# EAGLE design color_proximity_sensor (EAGLE 7.4.0)
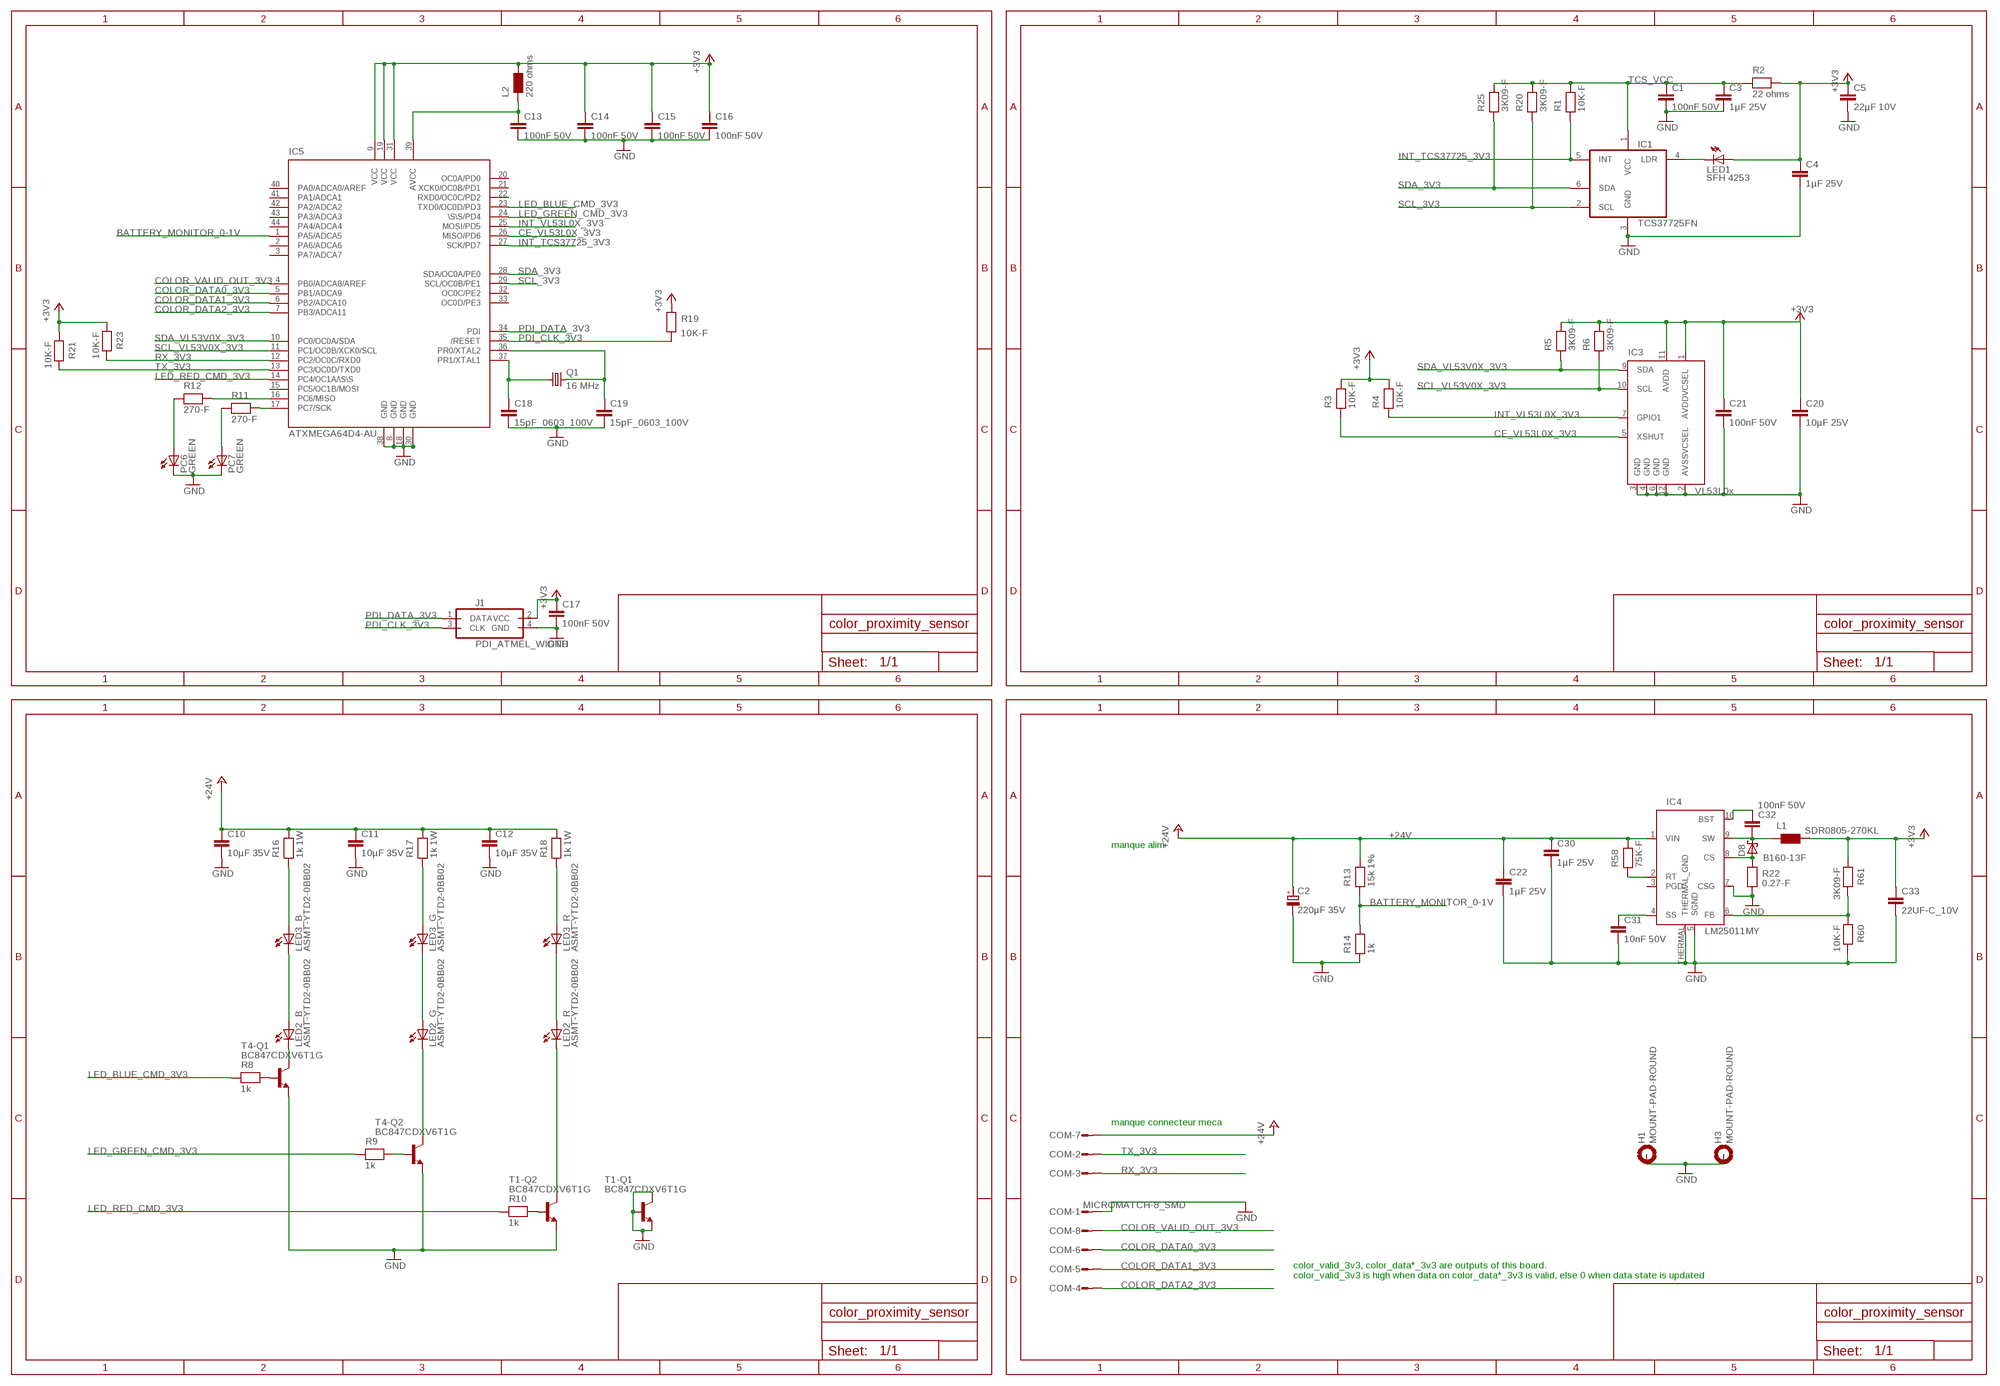
[diagram p0: schematic, sheet 1]

## Parts
C1  100nF 50V  100NF-F  [C0603]
C2  220µF 35V  220UFF_35V  [PANASONIC_F]
C3  1µF 25V  1UFD_25V  [C1206]
C4  1µF 25V  1UFD_25V  [C1206]
C5  22µF 10V  22UF-C_10V  [C1210]
C10  10µF 35V  10UF-C_35V  [C1210]
C11  10µF 35V  10UF-C_35V  [C1210]
C12  10µF 35V  10UF-C_35V  [C1210]
C13  100nF 50V  100NF-F  [C0603]
C14  100nF 50V  100NF-F  [C0603]
C15  100nF 50V  100NF-F  [C0603]
C16  100nF 50V  100NF-F  [C0603]
C17  100nF 50V  100NF-F  [C0603]
C18  15pF_0603_100V  15PF-F  [C0603]
C19  15pF_0603_100V  15PF-F  [C0603]
C20  10µF 25V  10UF-C_25V  [C1210]
C21  100nF 50V  100NF-F  [C0603]
C22  1µF 25V  1UFD_25V  [C1206]
C30  1µF 25V  1UFD_25V  [C1206]
C31  10nF 50V  10NF-F  [C0603]
C32  100nF 50V  100NF-F  [C0603]
C33  22UF-C_10V  [C1210]
COM  MICROMATCH-8_SMD  [MICROMATCH-8_SMD]
D8  B160-13F  [SMA]
H1  MOUNT-PAD-ROUND  [2,1-PAD]
H3  MOUNT-PAD-ROUND  [2,1-PAD]
IC1  TCS37725FN  [FN6]
IC3  VL53L0x  VL53L0X  [LGA12]
IC4  LM25011MY  [MSOP10_THERMAL]
IC5  ATXMEGA64D4-AU  [TQFP44]
J1  PDI_ATMEL_WIDTH  [HEADER_2.54MM_2X2W_]
L1  SDR0805-270KL  [SDR0805]
L2  220 ohms  FERRITE_220OHMS  [R0603]
LED1  SFH 4253  SFH4253  [SFH4253]
LED2  ASMT-YTD2-0BB02  LED_MULTICOLOR  [PLCC6]
LED3  ASMT-YTD2-0BB02  LED_MULTICOLOR  [PLCC6]
PC6  GREEN  LED_G  [CHIP-LED0805]
PC7  GREEN  LED_G  [CHIP-LED0805]
Q1  16 MHz  CRYSTAL_16MHZ_HC49UP  [HC49UP]
R1  10K-F  [R0603]
R2  22 ohms  22-F  [R0603]
R3  10K-F  [R0603]
R4  10K-F  [R0603]
R5  3K09-F  [R0603]
R6  3K09-F  [R0603]
R8  1k  1K-F  [R0603]
R9  1k  1K-F  [R0603]
R10  1k  1K-F  [R0603]
R11  270-F  [R0603]
R12  270-F  [R0603]
R13  15k 1%  15K-E  [R0805]
R14  1k  1K-E  [R0805]
R16  1k 1W  1K-A  [R2512]
R17  1k 1W  1K-A  [R2512]
R18  1k 1W  1K-A  [R2512]
R19  10K-F  [R0603]
R20  3K09-F  [R0603]
R21  10K-F  [R0603]
R22  0.27-F  [R0603]
R23  10K-F  [R0603]
R25  3K09-F  [R0603]
R58  75K-F  [R0603]
R60  10K-F  [R0603]
R61  3K09-F  [R0603]
T1  BC847CDXV6T1G  BC847CDXV6T  [SOT563-6]
T4  BC847CDXV6T1G  BC847CDXV6T  [SOT563-6]

## Nets
+3V3: C4.1 C5.1 C14.1 C15.1 C16.1 C17.1 C20.1 C21.1 C33.1 IC3.1(AVDDVCSEL) IC3.11(AVDD) IC5.9(VCC) IC5.19(VCC) IC5.31(VCC) J1.2(VCC) L1.2 L2.2 LED1.A R2.2 R3.2 R4.2 R5.2 R6.2 R19.2 R21.1 R23.1 R61.1
+24V: C2.+ C10.1 C11.1 C12.1 C22.1 C30.1 COM.7 IC4.1(VIN) R13.2 R16.2 R17.2 R18.2 R58.2
BATTERY_MONITOR_0-1V: IC5.1(PA5/ADCA5) R13.1 R14.2
CE_VL53L0X_3V3: IC3.5(XSHUT) IC5.26(MISO/PD6) R3.1
COLOR_DATA0_3V3: COM.6 IC5.5(PB1/ADCA9)
COLOR_DATA1_3V3: COM.5 IC5.6(PB2/ADCA10)
COLOR_DATA2_3V3: COM.4 IC5.7(PB3/ADCA11)
COLOR_VALID_OUT_3V3: COM.8 IC5.4(PB0/ADCA8/AREF)
GND: C1.2 C2.- C3.2 C4.2 C5.2 C10.2 C11.2 C12.2 C13.2 C14.2 C15.2 C16.2 C17.2 C18.2 C19.2 C20.2 C21.2 C22.2 C30.2 C31.2 C33.2 COM.1 H1.B2,8(MOUNT) H3.B2,8(MOUNT) IC1.3(GND) IC3.2(AVSSVCSEL) IC3.3(GND) IC3.4(GND) IC3.6(GND) IC3.12(GND) IC4.5(SGND) IC4.7(CSG) IC4.THERMAL(THERMAL_GND) IC5.8(GND) IC5.18(GND) IC5.30(GND) IC5.38(GND) J1.4(GND) PC6.C PC7.C R14.1 R22.1 R60.2 T1.1(-Q2:E) T1.3(-Q1:C) T1.4(-Q1:E) T1.5(-Q1:B) T4.1(-Q2:E) T4.4(-Q1:E)
INT_TCS37725_3V3: IC1.5(INT) IC5.27(SCK/PD7) R1.1
INT_VL53L0X_3V3: IC3.7(GPIO1) IC5.25(MOSI/PD5) R4.1
LED_BLUE_CMD_3V3: IC5.23(TXD0/OC0D/PD3) R8.1
LED_GREEN_CMD_3V3: IC5.24(\S\S/PD4) R9.1
LED_RED_CMD_3V3: IC5.14(PC4/OC1A/\S\S) R10.1
N$1: R8.2 T4.5(-Q1:B)
N$3: R9.2 T4.2(-Q2:B)
N$4: IC1.4(LDR) LED1.C
N$5: R10.2 T1.2(-Q2:B)
N$6: LED3.4(_R:A) R18.1
N$7: LED2.2(_G:C) T4.6(-Q2:C)
N$8: LED2.3(_R:C) T1.6(-Q2:C)
N$9: LED2.1(_B:C) T4.3(-Q1:C)
N$10: LED2.6(_B:A) LED3.1(_B:C)
N$11: LED3.5(_G:A) R17.1
N$12: LED3.6(_B:A) R16.1
N$13: IC5.17(PC7/SCK) R11.2
N$14: LED2.5(_G:A) LED3.2(_G:C)
N$15: LED2.4(_R:A) LED3.3(_R:C)
N$16: IC5.16(PC6/MISO) R12.2
N$17: C13.1 IC5.39(AVCC) L2.1
N$19: C18.1 IC5.37(PR1/XTAL1) Q1.1
N$20: C19.1 IC5.36(PR0/XTAL2) Q1.2
N$21: PC7.A R11.1
N$22: PC6.A R12.1
N$38: C32.2 D8.C IC4.9(SW) L1.1
N$39: D8.A IC4.8(CS) R22.2
N$40: IC4.2(RT) R58.1
N$43: C31.1 IC4.4(SS)
N$44: IC4.6(FB) R60.1 R61.2
N$48: C32.1 IC4.10(BST)
PDI_CLK_3V3: IC5.35(/RESET) J1.3(CLK) R19.1
PDI_DATA_3V3: IC5.34(PDI) J1.1(DATA)
RX_3V3: COM.3 IC5.12(PC2/OC0C/RXD0) R23.2
SCL_3V3: IC1.2(SCL) IC5.29(SCL/OC0B/PE1) R20.1
SCL_VL53V0X_3V3: IC3.10(SCL) IC5.11(PC1/OC0B/XCK0/SCL) R6.1
SDA_3V3: IC1.6(SDA) IC5.28(SDA/OC0A/PE0) R25.1
SDA_VL53V0X_3V3: IC3.9(SDA) IC5.10(PC0/OC0A/SDA) R5.1
TCS_VCC: C1.1 C3.1 IC1.1(VCC) R1.2 R2.1 R20.2 R25.2
TX_3V3: COM.2 IC5.13(PC3/OC0D/TXD0) R21.2
Unconnected: IC4.3(PGD) IC5.2(PA6/ADCA6) IC5.3(PA7/ADCA7) IC5.15(PC5/OC1B/MOSI) IC5.20(OC0A/PD0) IC5.21(XCK0/OC0B/PD1) IC5.22(RXD0/OC0C/PD2) IC5.32(OC0C/PE2) IC5.33(OC0D/PE3) IC5.40(PA0/ADCA0/AREF) IC5.41(PA1/ADCA1) IC5.42(PA2/ADCA2) IC5.43(PA3/ADCA3) IC5.44(PA4/ADCA4)

## Notes on the sheet
- manque alim
- manque connecteur meca
- color_valid_3v3, color_data*_3v3 are outputs of this board.
  color_valid_3v3 is high when data on color_data*_3v3 is valid, else 0 when data state is updated

## Library data of the parts
C1 C13-C17 C21 C32 = robotter_capacitor:100NF; MOUSER: 81-GRM188F51H104ZA01; RS: 723-5534
C2 = robotter_capacitor:220UF; MOUSER: 667-EEE-FP1V221AP; RS: 568-828
C3 C4 C22 C30 = robotter_capacitor:1UF; MOUSER: 810-C3216X7R1E105K-6; RS: 740-7574
C5 = robotter_capacitor:22UF; MOUSER: 581-1210ZG226Z; RS: 698-3844
C10-C12 = robotter_capacitor:10UF; MOUSER: 963-GMK325BJ106MN-T; RS: 758-3325
C18 C19 = robotter_capacitor:15PF; MOUSER: 581-06031A150K4T2A; RS: 147-421
C20 = robotter_capacitor:10UF; MOUSER: 963-TMK316BJ106KL-T; RS: 766-1185
C31 = robotter_capacitor:10NF; MOUSER: 81-GCM188R71H103KA7D; RS: 723-4982
C33 = robotter_capacitor:22UF; MOUSER: 581-1210ZG226Z; RS: 698-3844; VALUE: 22µF 10V
COM = robotter_connector:MICROMATCH-8_SMD: Ref FN : 1865096; FARNELL: 1865096; MOUSER: 571-7-188275-8; RS: 739-1227
D8 = robotter_diode:B160-13F; MOUSER: 621-B160-F; RS: 738-4765
H1 H3 = robotter_others:MOUNT-PAD-ROUND: MOUNTING PAD, round
IC1 = robotter_ic:TCS3772; I2C_ADDRESS: 0x29; MOUSER: 985-TCS37725FN; RS: 785-7749
IC3 = robotter_ic:VL53L0X
IC4 = robotter_ic:LM25011: 42V 2A step down switching regulator http://www.ti.com/product/lm25011; MOUSER: 926-LM25011MY/NOPB; RS: 761-4883
IC5 = robotter_ic:ATXMEGA64D4; MOUSER: 556-ATXMEGA64D4-AU
J1 = robotter_connector:PDI_ATMEL_WIDTH
L1 = robotter_inductor:SDR0805; MOUSER: 652-SDR0805-270KL; RS: 736-1282
L2 = robotter_inductor:FERRITE_220OHMS; MOUSER: 81-BLM18BB221SN1D; RS: 724-1302
LED1 = robotter_diode:SFH4253; MOUSER: 720-SFH4253-Z; RS: 665-5495
LED2 LED3 = robotter_diode:LED_MULTICOLOR; FARNELL: 1863245; MANUFACTURER: AVAGO TECHNOLOGIES; MOUSER: 630-ASMT-YTD2-0BB02; RS: 769-3520
PC6 PC7 = robotter_diode:LED_; MOUSER: 859-LTST-C171GKT; RS: 692-0935
Q1 = robotter_ic:CRYSTAL_: CRYSTAL; MOUSER: 559-FOXSD160-20-LF; RS: 547-6531
R1 R3 R4 R19 R21 R23 R60 = robotter_resistor:10K; MOUSER: 652-CR0603-JW-103ELF; RS: 740-8899
R2 = robotter_resistor:22; MOUSER: 660-RK73H1JTTD22R0F; RS: 213-2042
R5 R6 R20 R25 R61 = robotter_resistor:3K09; MOUSER: 667-ERA-3AEB3091V; RS: 708-7574
R8-R10 = robotter_resistor:1K; MOUSER: 71-CRCW0603-1.0K-E3; RS: 213-2266
R11 R12 = robotter_resistor:270; MOUSER: 71-CRCW0603J-270-E3; RS: 679-0071
R13 = robotter_resistor:15K; MOUSER: 660-RK73H2ATTD1502F; RS: 740-8997
R14 = robotter_resistor:1K; MOUSER: 71-CRCW0805-1.0K-E3; RS: 223-0427
R16-R18 = robotter_resistor:1K; MOUSER: 279-35201K0JT; RS: 224-0395
R22 = robotter_resistor:0.27; MOUSER: 603-RL0603FR070R27L; RS: 722-1046
R58 = robotter_resistor:75K; MOUSER: 660-RK73H1JTTD7502F; RS: 679-0695
T1 T4 = robotter_ic:BC847CDXV6T; MOUSER: 863-BC847CDXV6T1G; RS: 773-7627

## Board
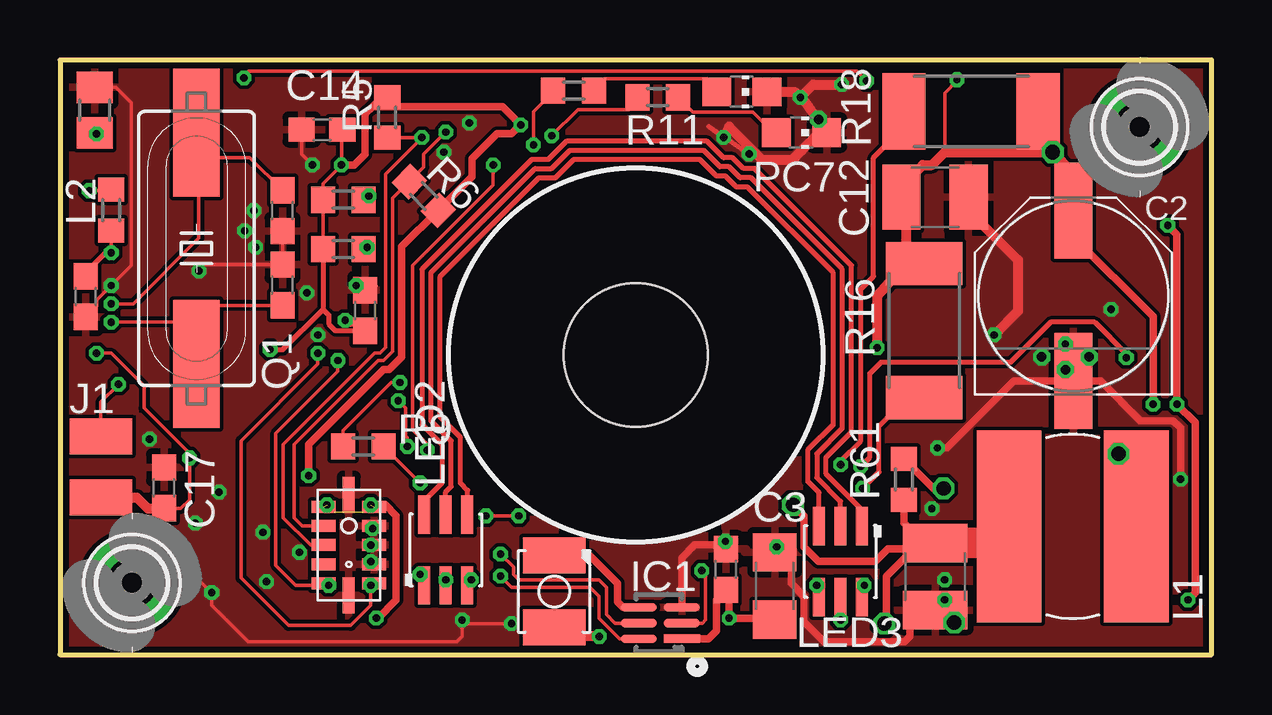
[diagram p1: board, top side]
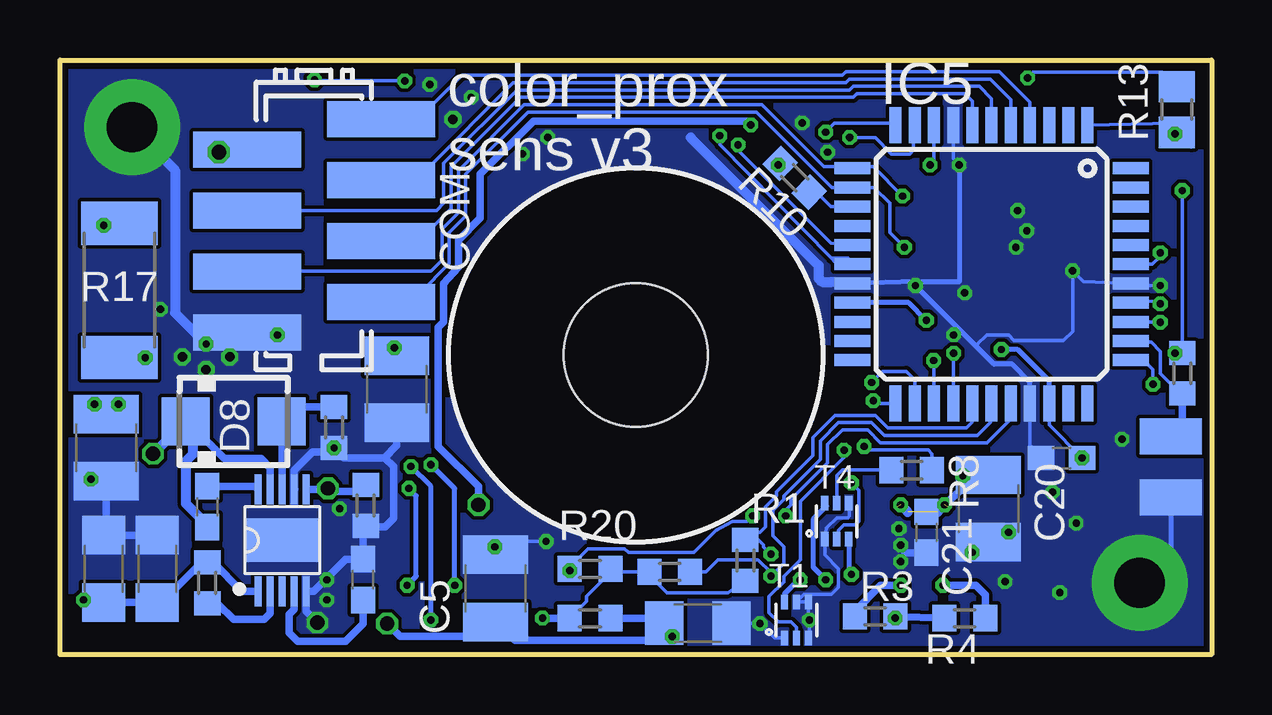
[diagram p2: board, bottom side, seen from below]

Size 48 x 24.8 mm. Coordinates in mm from the lower left corner, seen from the top.
Outline: 0,0 48,0 48,24.8 0,24.8 0,0
Copper layers (1*16): Top 0.035mm / dielectric 1.6mm / Bottom 0.035mm
Design rules "SeeedStudio_DRU_2layer": minimum track width 6mil, minimum drill 12mil, track to track 6mil, track to pad 6mil, pad to pad 6mil, via to via 6mil, smd to smd 0mil, copper to edge 10mil, drill to drill 10mil, minimum pad ring 6mil, minimum via ring 6mil, stop-mask expansion 2mil, vias tented up to drill 25mil, thermal gap 10mil
Holes 6 mm at 24,12.5
tRestrict: area 16.2,4.7 to 31.8,20.3
bRestrict: area 16.2,4.7 to 31.8,20.3

### Footprints (pad centres in the part's own frame; a part is rotated, then mirrored left to right if it is on the bottom)
C0603 = smd 1.1 x 1: 1 -0.85,0; 2 0.85,0
PANASONIC_F = smd 4 x 1.6: + 3.55,0; - -3.55,0
C1206 = smd 1.6 x 1.8: 1 -1.4,0; 2 1.4,0
C1210 = smd 1.6 x 2.7: 1 -1.4,0; 2 1.4,0
MICROMATCH-8_SMD = smd 1.5 x 4.5: 1 4.445,-2.794; 2 3.175,2.794; 3 1.905,-2.794; 4 0.635,2.794; 5 -0.635,-2.794; 6 -1.905,2.794; 7 -3.175,-2.794; 8 -4.445,2.794
SMA = smd 2 x 2: A 2,0; C -2,0
2,1-PAD = drill 2.1 pad 4: B2,8 0,0
FN6 = smd 0.35 x 1.5: 1 -0.65,-0.9; 2 0,-0.9; 3 0.65,-0.9; 4 0.65,0.9; 5 0,0.9; 6 -0.65,0.9
LGA12 = smd 0.5 x 1: 1 1.6,-1.05; 2 0.8,-1.05; 3 0,-1.05; 4 -0.8,-1.05; 5 -1.6,-1.05; 7 -1.6,1.05; 8 -0.8,1.05; 9 0,1.05; 10 0.8,1.05; 11 1.6,1.05 | smd 1.5 x 0.5: 6 -2.1,0; 12 2.1,0
MSOP10_THERMAL = smd 0.3 x 1.25: 1 -1,-2.127; 2 -0.5,-2.127; 3 0,-2.127; 4 0.5,-2.127; 5 1,-2.127; 6 1,2.127; 7 0.5,2.127; 8 0,2.127; 9 -0.5,2.127; 10 -1,2.127 | smd 3 x 1.8: THERMAL 0,0
TQFP44 = smd 1.5 x 0.5: 1 -5.8,4; 2 -5.8,3.2; 3 -5.8,2.4; 4 -5.8,1.6; 5 -5.8,0.8; 6 -5.8,0; 7 -5.8,-0.8; 8 -5.8,-1.6; 9 -5.8,-2.4; 10 -5.8,-3.2; 11 -5.8,-4; 23 5.8,-4; 24 5.8,-3.2; 25 5.8,-2.4; 26 5.8,-1.6; 27 5.8,-0.8; 28 5.8,0; 29 5.8,0.8; 30 5.8,1.6; 31 5.8,2.4; 32 5.8,3.2; 33 5.8,4 | smd 0.5 x 1.5: 12 -4,-5.8; 13 -3.2,-5.8; 14 -2.4,-5.8; 15 -1.6,-5.8; 16 -0.8,-5.8; 17 0,-5.8; 18 0.8,-5.8; 19 1.6,-5.8; 20 2.4,-5.8; 21 3.2,-5.8; 22 4,-5.8; 34 4,5.8; 35 3.2,5.8; 36 2.4,5.8; 37 1.6,5.8; 38 0.8,5.8; 39 0,5.8; 40 -0.8,5.8; 41 -1.6,5.8; 42 -2.4,5.8; 43 -3.2,5.8; 44 -4,5.8
HEADER_2.54MM_2X2W_ = smd 2.6 x 1.5: 1 1.7,1.27; 2 1.7,-1.27 | smd 2.6 x 1.5 bottom: 3 1.7,1.27; 4 1.7,-1.27
SDR0805 = smd 8 x 2.7: 1 0,-2.65; 2 0,2.65
R0603 = smd 1 x 1.1: 1 -0.85,0; 2 0.85,0
SFH4253 = smd 2.6 x 1.5: A 0,1.5; C 0,-1.5
PLCC6 = smd 1.6 x 0.5: 1 1.475,-0.9; 2 1.475,0; 3 1.475,0.9; 4 -1.475,0.9; 5 -1.475,0; 6 -1.475,-0.9
CHIP-LED0805 = smd 1.2 x 1.2: A 0,-1.05; C 0,1.05
HC49UP = smd 5.334 x 1.93: 1 -4.826,0; 2 4.826,0
R0805 = smd 1.3 x 1.5: 1 -0.95,0; 2 0.95,0
R2512 = smd 1.8 x 3.2: 1 -2.8,0; 2 2.8,0
SOT563-6 = smd 0.3 x 0.6: 1 -0.5,-0.75; 2 0,-0.75; 3 0.5,-0.75; 4 0.5,0.75; 5 0,0.75; 6 -0.5,0.75

### Placement (x,y rotation side)
C1  27.76,3.56 90 top
C2  42.24,14.96 90 top
C3  29.79,2.87 90 top
C4  21.41,1.32 0 bottom
C5  29.84,2.77 90 bottom
C10  33.96,11.07 270 bottom
C11  46.08,8.64 270 bottom
C12  36.47,19.08 0 top
C13  1.07,14.94 270 top
C14  10.92,21.89 180 top
C15  12.73,14.35 90 top
C16  6.25,8.2 180 bottom
C17  4.34,6.96 90 top
C18  9.27,18.52 270 top
C19  9.27,15.42 90 top
C20  9.3,6.1 270 bottom
C21  11.89,5.11 270 bottom
C22  46.18,3.58 90 bottom
C30  43.94,3.58 90 bottom
C31  35.37,3.13 90 bottom
C32  41.86,6.17 270 bottom
C33  36.48,3.26 270 top
COM  37.41,17.88 270 bottom
D8  40.77,9.73 0 bottom
H1  3,3 0 top
H3  45,22 0 top
IC1  25.02,1.32 90 top
IC3  12.04,4.57 90 top
IC4  38.73,4.78 0 bottom
IC5  9.17,16.28 270 bottom
J1  0,7.82 0 top
L1  42.21,5.36 90 top
L2  2.13,18.54 90 top
LED1  20.6,2.64 180 top
LED2  16.08,4.37 270 top
LED3  32.54,3.89 90 top
PC6  28.42,23.47 270 top
PC7  30.91,21.77 270 top
Q1  5.69,16.94 270 top
R1  19.43,3.94 270 bottom
R2  25.91,1.52 0 bottom
R3  14.02,1.6 0 bottom
R4  10.29,1.52 180 bottom
R5  13.64,22.4 90 top
R6  15.16,19.13 315 top
R8  12.5,7.7 180 bottom
R9  12.65,8.69 0 top
R10  17.37,19.89 135 bottom
R11  24.92,23.24 180 top
R12  21.41,23.52 180 top
R13  1.45,22.73 90 bottom
R14  1.45,22.71 270 top
R16  36.02,13.51 90 top
R17  45.52,15.19 90 bottom
R18  37.97,22.66 0 top
R19  1.22,11.73 90 bottom
R20  25.91,3.58 0 bottom
R21  11.81,16.92 0 top
R22  36.58,9.47 90 bottom
R23  11.81,18.97 0 top
R25  22.58,3.45 180 bottom
R58  41.86,3 90 bottom
R60  35.26,6.22 270 bottom
R61  35.18,7.32 90 top
T1  17.3,1.45 0 bottom
T4  15.62,5.56 0 bottom

### Tracks (layer width: path | path; a pad name or v marks a point on that pad's centre or on a via)
+3V3  (via drill 0.3, 0.6)  (4 unrouted)
  Top 0.152: v1.22,19.36 2.1,19.36 L2.2 | C14.1 11.73,21.86 v11.73,20.42 10.96,19.65 R23.1 R21.1 | v1.52,12.57 2.13,12.57 3.5,11.2 3.5,10.29 5.36,8.43 C16.1 5.4,6.46 5.03,6.1 4.36,6.1 C17.1
  Top 0.203: v11.89,13.95 12.04,13.79 12.72,13.79 C15.1 11.49,13.5 11.2,13.79 11.2,14.17 10.97,14.4 10.96,14.4 | R21.1 10.96,14.4 | v8.76,12.72 9.29,12.72 10.96,14.4
  Top 0.305: v34.37,1.29 34.44,1.37 34.44,3.28 35.59,4.42 | 35.59,4.42 35.81,4.65 35.83,4.66 C33.1 35.86,4.83 35.18,5.5 R61.1 | 35.59,4.42 34.52,4.42 33.98,3.89 31.62,3.89 31.01,4.5 31.01,5.79 v30.56,6.25 | 13.03,22.86 18.44,22.86 v19.2,22.1 18.82,21.72 18.21,21.72 17.18,20.69 17.18,19.94 R6.2 14.25,17.01 14.25,12.42 13.72,11.89 13.49,11.89 10.36,8.78 v10.36,7.47 | 13.03,22.86 12.72,22.55 12.72,20.88 12.27,20.42 v11.73,20.42 | 12.88,6.25 v12.95,6.25 13.56,6.25 14.02,5.79 14.02,2.29 13.26,1.52 v13.18,1.52 | 13.03,22.86 13.42,23.25 R5.2
  Top 0.406: 35.43,4.65 35.81,4.65 36.06,4.65 C33.1 | v22.48,0.76 20.5,0.76 20.42,1.37 21.49,1.14 LED1.A | v11.12,6.25 11.09,6.33 | J1.2 3.2,6.55 3.66,6.1 4.33,6.1 C17.1
  Top 1.27: C33.1 39.56,4.66 L1.2
  Bottom 0.152: R19.2 v1.22,19.36 | R19.2 1.16,12.59 | IC5.9 11.57,20.59 v11.73,20.42 | C16.1 6.77,9.57 IC5.31 | R19.2 1.51,12.59 v1.52,12.57
  Bottom 0.203: v11.89,13.95 12.62,14.68 IC5.19 | IC5.31 6.77,11.42 8.08,12.72 v8.76,12.72
  Bottom 0.305: C4.1 22.91,1.32 23.32,1.68 v22.48,0.76 | C5.1 29.95,1.9 31.09,0.76 33.83,0.76 v34.37,1.29 | v30.56,6.25 30.56,7.01 32.23,8.69 32.23,13.64 32,13.87 32,15.47 31.39,16.15 31.39,17.3 30.48,18.21 30.48,20.04 28.27,22.25 19.36,22.25 v19.2,22.1 | C4.1 23.45,0.69 23.55,0.61 29.03,0.61 29.34,0.91 29.34,1.85 C5.1 | 28.88,1.9 C5.1 | R2.2 23.02,1.52 C4.1 | C20.1 10.09,7.51 v10.36,7.47 10.29,7.39 10.29,7.01 v11.12,6.25 | R4.2 R3.2 v13.18,1.52
  Bottom 0.406: 12.66,5.96 v12.95,6.25 | 11.42,5.96 v11.12,6.25
  other vias: 5.4,8.2
+24V  (via drill 0.3, 0.61)
  Top 0.152: 40.84,23.85 40.84,23.12 R18.2 | 36.88,20.95 36.88,23.42 37.39,23.93 v37.39,23.98 | v7.67,24.05 7.67,24.13 7.87,24.33 33.22,24.33 v33.63,23.93
  Top 0.305: v47.02,2.29 47.32,2.59 47.32,9.68 v46.56,10.44 46.56,17.53 v46.18,17.91 | C2.+ 42.24,17.42 45.57,14.1 v45.57,10.44
  Top 0.406: v41.38,20.95 41.38,22.59 R18.2 | C2.+ 42.24,20.09 v41.38,20.95 | R16.2 35.29,16.31 | 35.29,16.31 34.06,14.94 v34.06,12.8 | 35.29,16.31 35.29,18.86 C12.1 35.07,19.53 35.97,20.42 36.35,20.42 36.88,20.95 v41.38,20.95
  Bottom 0.152: R13.2 2.05,24.28 7.44,24.28 v7.67,24.05 | v33.63,23.93 37.34,23.93 v37.39,23.98
  Bottom 0.305: IC4.1 40.42,2.65 41.62,3.85 R58.2 41.79,3.63 42.32,3.63 43.74,2.21 | 43.81,2.21 43.74,2.21 | 43.74,2.21 C30.1 C22.1 46.91,2.18 v47.02,2.29 | v46.56,10.44 46.13,9.98 C11.1 45.59,10.04 arc-90 v45.57,10.44 | R17.2 45.6,17.91 v46.18,17.91
  Bottom 0.406: COM.7 41.27,21.06 v41.38,20.95 | v34.06,12.8 33.91,12.53 C10.1
BATTERY_MONITOR_0-1V  (via drill 0.3)
  Top 0.152: R14.2 1.41,21.76 0.84,21.18 v1.52,21.72
  Bottom 0.152: R13.1 0.84,21.17 v1.52,21.72 1.52,22.16 IC5.1
CE_VL53L0X_3V3  (via drill 0.3)
  Top 0.152: v12.95,2.9 12.95,2.06 12.12,1.22 9.53,1.22 7.54,3.2 7.54,8.91 10.74,12.12 v10.74,12.57
  Top 0.305: IC3.5 13.03,2.97 v12.95,2.9
  Bottom 0.152: v10.74,12.57 10.77,12.47 IC5.26 | R3.1 14.87,1.82
  Bottom 0.305: 14.87,1.82 13.79,2.9 v12.95,2.9
COLOR_DATA0_3V3
  Bottom 0.152: IC5.5 8.37,23.15 9.22,24 15.09,24 15.24,23.85 29.11,23.85 32.77,20.19 32.77,19.81 34.52,19.81 COM.6
COLOR_DATA1_3V3
  Bottom 0.152: IC5.6 9.17,23.19 9.68,23.7 14.94,23.7 15.09,23.55 28.96,23.55 32,20.5 32,18.82 32.31,18.52 COM.5
COLOR_DATA2_3V3
  Bottom 0.152: IC5.7 9.97,23.08 10.29,23.39 14.78,23.39 14.94,23.24 28.8,23.24 31.7,20.34 31.7,18.59 33.05,17.25 COM.4
COLOR_VALID_OUT_3V3
  Bottom 0.152: IC5.4 7.57,23.04 8.84,24.31 15.24,24.31 15.39,24.16 31.24,24.16 33.07,22.33 COM.8
GND  (via drill 0.3, 0.4, 0.6)
  Top 0.152: 27.6,4.72 v27.74,4.72 27.76,4.7 C1.2 | C13.2 1.52,14.54 1.52,14.78 v2.13,15.39 2.97,16.23 2.97,23.01 2.33,23.66 R14.1 | v5.79,16 6.06,16.27 C19.2 C18.2 | C14.2 10.07,20.86 v10.52,20.42 | C17.2 4.46,7.81 | H1.B2,8 5.92,3 v6.33,2.59 6.33,2.06 7.85,0.53 16.54,0.53 16.76,0.76 v16.76,1.45 16.92,1.29 v18.82,1.29 | C3.2 29.72,4.34 v29.87,4.5
  Top 0.203: C15.2 13.14,15.39 v12.34,15.39 | v28.73,20.88 27.05,22.02 v27.66,21.57
  Top 0.305: v37.27,1.34 36.45,1.35 C33.2 36.15,1.86 35.43,1.14 35.43,0.76 35.2,0.53 31.85,0.53 31.01,1.37 31.01,2.44 30.48,2.97 30.48,3.58 29.56,4.5 v29.87,4.5 29.87,4.27 | R22.1 36.97,8.62 39.76,11.41 C2.- 43.38,11.41 45.03,9.75 46.41,9.75 46.71,9.45 v46.71,7.32 | 25.54,1.97 IC1.3 25.92,4.05 26.44,4.57 27.58,4.57 v27.74,4.72 | IC3.3 v12.95,4.57
  Top 0.406: C2.- 42.24,12.62 v41.91,12.95 | C12.2 37.87,18.51 39.93,16.46 39.93,14.33 v38.94,13.34 | v27.66,21.57 27.89,22.02 29.29,20.62 30.53,20.62 30.94,21.03 31.6,21.71 PC7.C 31.07,23.03 v30.86,23.24 | PC6.C 30.63,23.47 v30.86,23.24 | v30.86,23.24 31.39,23.77 v32.59,23.77
  Bottom 0.152: v2.13,15.39 3.28,15.39 IC5.38 5.35,15.56 v5.79,16 5.79,13.49 6.17,13.11 8.23,13.11 8.46,13.34 9.37,13.34 9.75,12.95 9.75,12.8 | C5.2 28.95,4.72 v27.74,4.72 | v10.52,20.42 10.77,20.68 IC5.8 | IC5.30 7.57,8.75 C16.2 | C4.2 18.69,1.32 v18.82,1.29 18.22,0.7 T1.1 | 1.7,4.3 H1.B2,8 | T1.3 16.76,0.73 v16.76,1.45 16.8,1.48 T1.4 T1.5 16.98,2.52 15.85,2.52 15.54,2.82 15.54,3.58 16.12,4.16 T4.1 16.05,5.29 15.62,5.71 15.16,5.71 15.09,5.79 15.09,6.27 T4.4
  Bottom 0.203: J1.4 1.7,4.3 | 12.28,15.56 v12.34,15.39 9.75,12.8 9.07,12.12 8.31,12.12 7.57,11.38 IC5.30 | 12.28,15.56 IC5.18 | 12.28,15.56 10.52,15.56 v10.52,20.42
  Bottom 0.305: IC4.7 38.23,7.69 37.47,8.46 36.74,8.46 R22.1 36.17,8.21 34.46,8.21 | C30.2 C22.2 46.08,5.08 C11.2 46.78,7.24 v46.71,7.32 | v37.27,1.34 37.73,1.81 IC4.5 37.43,2.65 36.1,3.98 C31.2 35.37,5.26 R60.2 35.22,5.33 34.44,5.33 34.1,5.68 34.1,7.85 34.46,8.21 | C10.2 33.96,8.72 34.46,8.21 | v29.87,4.5 29.95,4.8 29.39,4.8 C5.2 | v12.95,4.57 12.79,4.25 C21.2
  Bottom 0.406: COM.1 41.43,13.44 v41.91,12.95 | v38.94,13.34 41.53,13.34 v41.91,12.95 | H3.B2,8 43.2,20.2 43.2,14.25 v41.91,12.95 | 21.72,21.57 16.38,16.23 16.38,15.7 16.23,15.54 15.85,15.54 15.71,15.56 IC5.18
  other vias: 36.58,8.62 3.73,8.99 8.08,18.52 7.7,17.68 8.15,16.99 10.29,15.09 10.74,13.34 43.81,14.4 17.07,22.17 31.62,22.33 40.92,12.42 42.9,12.42 41.91,11.89 36.35,6.1 36.88,3.12 36.88,2.29 13.03,5.26 12.95,3.89 6.63,6.78 5.64,5.49 8.61,3.05 9.98,4.27 8.46,5.11 16,20.95
  pour Top: 0,0 0,25.07 48.01,25.07 48.01,0
  pour Bottom (no thermals): 0,0 0,25.07 48.01,25.07 48.01,0
INT_TCS37725_3V3  (via drill 0.3)
  Top 0.152: v18.36,4.19 18.9,3.66 18.9,3.35 19.13,3.12 22.48,3.12 22.78,2.82 22.78,1.68 23.14,1.32 IC1.5
  Bottom 0.152: R1.1 19.27,4.95 | v18.36,4.19 18.67,4.5 18.67,4.57 18.88,4.79 R1.1 | R1.1 19.14,4.42 | IC5.27 9.98,10.47 9.98,9.68 10.21,9.45 13.49,9.45 14.02,9.98 15.7,9.98 16.61,9.07 16.61,8.31 18.14,6.78 18.14,6.63 18.59,6.17 18.59,5.33 18.82,5.11 19.05,5.11 19.37,4.79 R1.1
INT_VL53L0X_3V3  (via drill 0.3)
  Top 0.152: IC3.7 11.16,2.9 9.83,2.9 8.99,3.73 8.99,9.22 11.58,11.81 v11.58,12.27
  Top 0.305: IC3.7 11.24,2.93 v11.2,2.9
  Bottom 0.152: IC5.25 11.58,10.49 v11.58,12.27
  Bottom 0.305: R4.1 9.44,2.5 9.83,2.9 v11.2,2.9
LED_BLUE_CMD_3V3  (via drill 0.3)
  Top 0.152: v14.48,8.69 14.48,9.07 14.4,9.14 14.4,10.29 v14.1,10.59
  Bottom 0.152: v14.48,8.69 14.33,8.53 11.81,8.53 11.66,8.38 R8.1 | v14.1,10.59 13.99,10.48 IC5.23
LED_GREEN_CMD_3V3  (via drill 0.3)
  Top 0.152: R9.1 11.8,9.36 13.79,11.35 v14.17,11.35
  Bottom 0.152: v14.17,11.35 13.72,11.81 12.72,11.81 12.37,11.46 IC5.24
LED_RED_CMD_3V3
  Bottom 0.152: IC5.14 15.86,18.68 16.38,19.2 16.69,19.2 R10.1
N$1
  Bottom 0.152: T4.5 15.62,7.47 15.39,7.7 13.56,7.7
  Bottom 0.203: R8.2 13.56,7.7
N$3  (via drill 0.3)
  Top 0.152: R9.2 13.12,8.83 13.72,8.23 13.95,8.23 v15.01,7.16
  Bottom 0.152: 15.62,4.65 T4.2 15.54,5.18 15.32,5.41 14.86,5.41 14.71,5.56 14.71,6.86 v15.01,7.16
N$4
  Top 0.305: LED1.C 22.07,4.14 23.24,2.97 23.24,2.21 23.47,1.98 24.11,1.98 IC1.4
N$5  (via drill 0.3)
  Top 0.152: v15.32,8.53 15.32,8.76 14.71,9.37 14.71,16.23 18.06,19.58 v18.06,20.42
  Bottom 0.152: T1.2 17.3,1.14 17.53,1.37 18.06,1.37 18.44,1.75 18.44,2.44 17.83,3.05 17.83,3.28 17.14,3.96 17.14,6.4 15.32,8.23 v15.32,8.53 | v18.06,20.42 18.15,20.49 R10.2
N$6  (via drill 0.3)
  Top 0.152: 35.6,22.55 35.6,22.42
  Top 0.203: LED3.4 31.64,2.68 v31.55,2.9 | v32.54,7.92 32.54,8.08 33.38,8.91 33.38,15.24 33.91,15.77 33.91,20.73 35.6,22.42 | 35.6,22.55 R18.1
  Bottom 0.203: v31.55,2.9 31.55,6.93 v32.54,7.92
N$7  (via drill 0.3)
  Top 0.152: LED2.2 v16.08,3.12
  Bottom 0.203: T4.6 16.05,6.21 16.61,5.64 16.61,3.66 v16.08,3.12
N$8  (via drill 0.3)
  Top 0.152: LED2.3 17.13,3.19 v17.14,3.12
  Bottom 0.203: v17.14,3.12 17.22,3.12 17.8,2.55 T1.6
N$9  (via drill 0.3)
  Top 0.152: LED2.1 15.25,3.03 v15.01,3.35
  Bottom 0.203: T4.3 15.12,3.47 v15.01,3.35
N$10
  Top 0.203: LED2.6 15.33,6.57 15.93,7.16 15.93,8.76 15.09,9.6 15.09,16.08 19.66,20.65 20.34,20.65 21.11,21.41 26.98,21.41 27.66,20.73 28.04,20.73 28.5,20.27 28.96,20.27 32.99,16.23 32.99,9.3 31.93,8.23 31.93,7.54 33.44,6.03 LED3.1
N$11  (via drill 0.3)
  Top 0.203: LED3.5 v32.54,1.45 | v33.38,7.85 33.76,8.23 33.76,11.73 34.21,12.19 39.62,12.19 41.3,13.87 43.13,13.87 44.45,12.55 v44.45,12.39
  Bottom 0.152: 45.47,12.34 R17.1
  Bottom 0.203: v32.54,1.45 32.54,7.01 v33.38,7.85 | v44.45,12.39 45.47,12.34 44.88,12.34 44.93,12.39 v44.45,12.39
N$12  (via drill 0.3)
  Top 0.203: LED3.6 33.3,2.32 v33.53,2.9 | v33.45,6.93 34.14,7.62 34.14,9.53 34.98,10.36 35.17,10.03 R16.1
  Bottom 0.203: v33.53,2.9 33.15,3.28 33.15,6.63 v33.45,6.93
N$13  (via drill 0.3)
  Top 0.152: v20.5,21.64 21.59,22.73 23.72,22.73 24.07,23.08 R11.2
  Bottom 0.152: IC5.17 15.15,16.54 15.85,16.54 | 15.85,16.54 15.67,16.36 | 15.85,16.54 20.5,21.26 v20.5,21.64
N$14
  Top 0.203: LED2.5 16.08,6.78 16.31,7.01 16.31,8.91 15.47,9.75 15.47,15.93 19.81,20.27 20.5,20.27 21.26,21.03 26.82,21.03 27.51,20.34 27.89,20.34 28.35,19.89 28.8,19.89 32.61,16.08 32.61,9.45 31.55,8.38 31.55,7.39 32.54,6.4 LED3.2
N$15
  Top 0.203: LED2.4 16.99,5.98 16.99,6.86 16.69,7.16 16.69,9.07 15.85,9.91 15.85,15.77 19.96,19.89 20.65,19.89 21.41,20.65 26.67,20.65 27.36,19.96 27.74,19.96 28.19,19.51 28.65,19.51 32.23,15.93 32.23,9.6 31.17,8.53 31.17,7.24 31.64,6.77 LED3.3
N$16  (via drill 0.3)
  Top 0.152: v19.74,21.26 19.74,22.64 20.56,23.47 20.57,23.47 R12.2
  Bottom 0.152: IC5.16 15.86,17.16 19.74,21.03 v19.74,21.26
N$17  (via drill 0.3)
  Top 0.152: C13.1 1.37,15.85 | 2.13,16.61 v2.13,16.76 L2.1
  Top 0.203: 1.37,15.85 1.29,15.93 1.29,16.15 1.91,16.76 v2.13,16.76
  Bottom 0.152: v2.13,16.76 2.13,16.61 2.46,16.28 IC5.39
N$19  (via drill 0.3)
  Top 0.152: Q1.1 5.79,21.67 5.79,20.73 | 5.79,20.73 5.79,17.37 3.05,14.63 v2.13,14.63 | C18.1 7.91,20.73 5.79,20.73
  Bottom 0.152: v2.13,14.63 2.26,14.76 IC5.37
N$20  (via drill 0.3)
  Top 0.152: Q1.2 5.61,13.87 | 5.61,13.87 v2.13,13.87 | C19.1 5.61,14.57 5.61,13.87
  Bottom 0.152: v2.13,13.87 2.15,13.88 IC5.36
N$21
  Top 0.152: PC7.A 29.72,21.79 28.88,22.63 26.38,22.63 R11.1
N$22
  Top 0.152: R12.1 22.26,23.58 22.71,24.03 26.97,24.03 PC6.A
N$38  (via drill 0.6)
  Top 0.406: v44.12,8.38 44.12,8.69 44.94,8.59 L1.1
  Bottom 0.305: IC4.9 39.23,7.79 39.62,8.18 41.15,8.18 42.7,9.73 D8.C
  Bottom 0.406: v44.12,8.38 43.2,9.3 D8.C 42.42,9.38 42.44,9.22 42.44,8.38 42.75,8.08 42.75,6.3 42.04,5.59 41.74,5.51 C32.2
N$39
  Bottom 0.305: IC4.8 38.73,9.7 D8.A 38.17,10.32 R22.2
N$40
  Bottom 0.305: R58.1 41.4,2.11 40.77,1.47 39.5,1.47 39.24,1.73 39.24,2.64 IC4.2
N$43
  Bottom 0.305: IC4.4 38.23,1.9 38.46,1.68 38.46,0.91 38.1,0.56 36.09,0.56 35.36,1.29 35.36,2.27 C31.1
N$44  (via drill 0.6)
  Top 0.305: v36.83,6.93 36.41,6.93 R61.2
  Bottom 0.305: IC4.6 36.86,6.9 v36.83,6.93 36.7,6.81 35.52,6.81 R60.1
N$48
  Bottom 0.305: C32.1 39.85,7.02 IC4.10
PDI_CLK_3V3
  Bottom 0.152: R19.1 1.13,10.73 2.13,11.73 2.13,12.65 2.52,13.03 3.42,13.03 IC5.35
  Bottom 0.305: R19.1 1.22,9.57 J1.3
PDI_DATA_3V3  (via drill 0.3)
  Top 0.152: v2.44,11.28 1.7,10.54 J1.1
  Bottom 0.152: IC5.34 2.83,12.28 2.44,11.89 v2.44,11.28
RX_3V3  (via drill 0.3)
  Top 0.152: v12.88,19.13 13.03,19.19 R23.2
  Bottom 0.152: 14.98,20.34 16.15,20.34 18.75,22.94 28.65,22.94 31.39,20.19 31.39,18.44 32.08,17.75 32.08,16.46 32.54,16 40.11,16 COM.3 | 14.98,20.34 IC5.12 | 14.98,20.34 14.1,20.34 v12.88,19.13
SCL_3V3  (via drill 0.3)
  Top 0.152: v19.13,5.79 v17.75,5.79 | IC1.2 26.77,1.32 26.9,1.45 26.9,3.35 v26.75,3.5
  Bottom 0.152: IC5.29 8.46,10.39 8.46,9.75 9.37,8.84 13.79,8.84 14.33,9.37 15.39,9.37 16,8.76 16,8 17.53,6.48 17.53,6.25 17.75,6.02 v17.75,5.79 | v19.13,5.79 19.36,5.56 19.96,5.56 20.65,5.18 21.57,4.27 24.31,4.27 24.46,4.42 25.98,4.42 26.76,3.65 R20.1 v26.76,3.52 v26.75,3.5
SCL_VL53V0X_3V3  (via drill 0.3)
  Top 0.152: IC3.10 10.1,5.37 9.75,5.71 9.75,8.76 13.26,12.27 13.49,12.27 13.87,12.65 13.87,19.03 R6.1 15.16,20.33 15.16,20.88 v16.08,21.79
  Bottom 0.152: v16.08,21.79 15.71,22.16 13.24,22.16 13.18,22.1 IC5.11
SDA_3V3  (via drill 0.3)
  Top 0.152: 18.47,3.15 v18.36,3.28 18.82,2.82 22.1,2.82 22.48,2.44 22.48,1.52 23.33,0.67 IC1.6
  Bottom 0.152: R25.1 21.08,3.45 20.57,3.96 18.9,3.96 18.36,3.43 v18.36,3.28 17.83,3.81 17.83,4.5 18.29,4.95 18.29,6.02 17.83,6.48 17.83,6.63 16.31,8.15 16.31,8.91 15.54,9.68 14.17,9.68 13.64,9.14 9.75,9.14 9.22,9.68 9.22,10.43 IC5.28
SDA_VL53V0X_3V3  (via drill 0.3)
  Top 0.152: IC3.9 10.44,4.57 9.3,5.71 9.3,8.76 13.11,12.57 13.34,12.57 13.56,12.8 13.56,20.04 v15.09,21.57 13.65,21.57 R5.1
  Bottom 0.152: v15.09,21.57 14.02,21.57 13.34,20.88 12.57,20.88 12.42,21.03 12.42,22.03 IC5.10
TCS_VCC  (via drill 0.3)
  Top 0.305: C3.1 29.74,1.52 v27.89,1.52 27.89,2.44 27.76,2.56 C1.1 27.36,2.3 27.36,0.99 27.04,0.67 IC1.1
  Bottom 0.152: R1.2 20.16,2.59 22.71,2.59 23.43,3.31 R25.2 25.06,3.45 | R20.2 25.06,3.45 | 25.06,3.45 25.06,3.44 26.06,2.44 26.06,2.22 R2.1
  Bottom 0.305: R2.1 v27.89,1.52
TX_3V3  (via drill 0.3)
  Top 0.152: R21.2 v12.8,16.99
  Bottom 0.152: v12.8,16.99 13.41,17.6 13.41,18.82 14.07,19.48 IC5.13 15.82,19.48 18.97,22.63 28.5,22.63 31.09,20.04 31.09,18.29 31.77,17.6 31.77,16.31 32.99,15.09 COM.2

### Text on the board
bNames: color_prox / sens v3